# EasyEDA Pro project MalO_SAO_EasyEDA.eprj, schematic Schematic1

## Sheets
1 Periphreals: Board Name: Board1; Create Date: 2026-02-11; Page Name: Periphreals; Project Name: MalO_SAO_EasyEDA; Schematic Name: Schematic1; Update Date: 2026-05-29; Company: EasyEDA.com; Page Size: A4; Version: V1.0
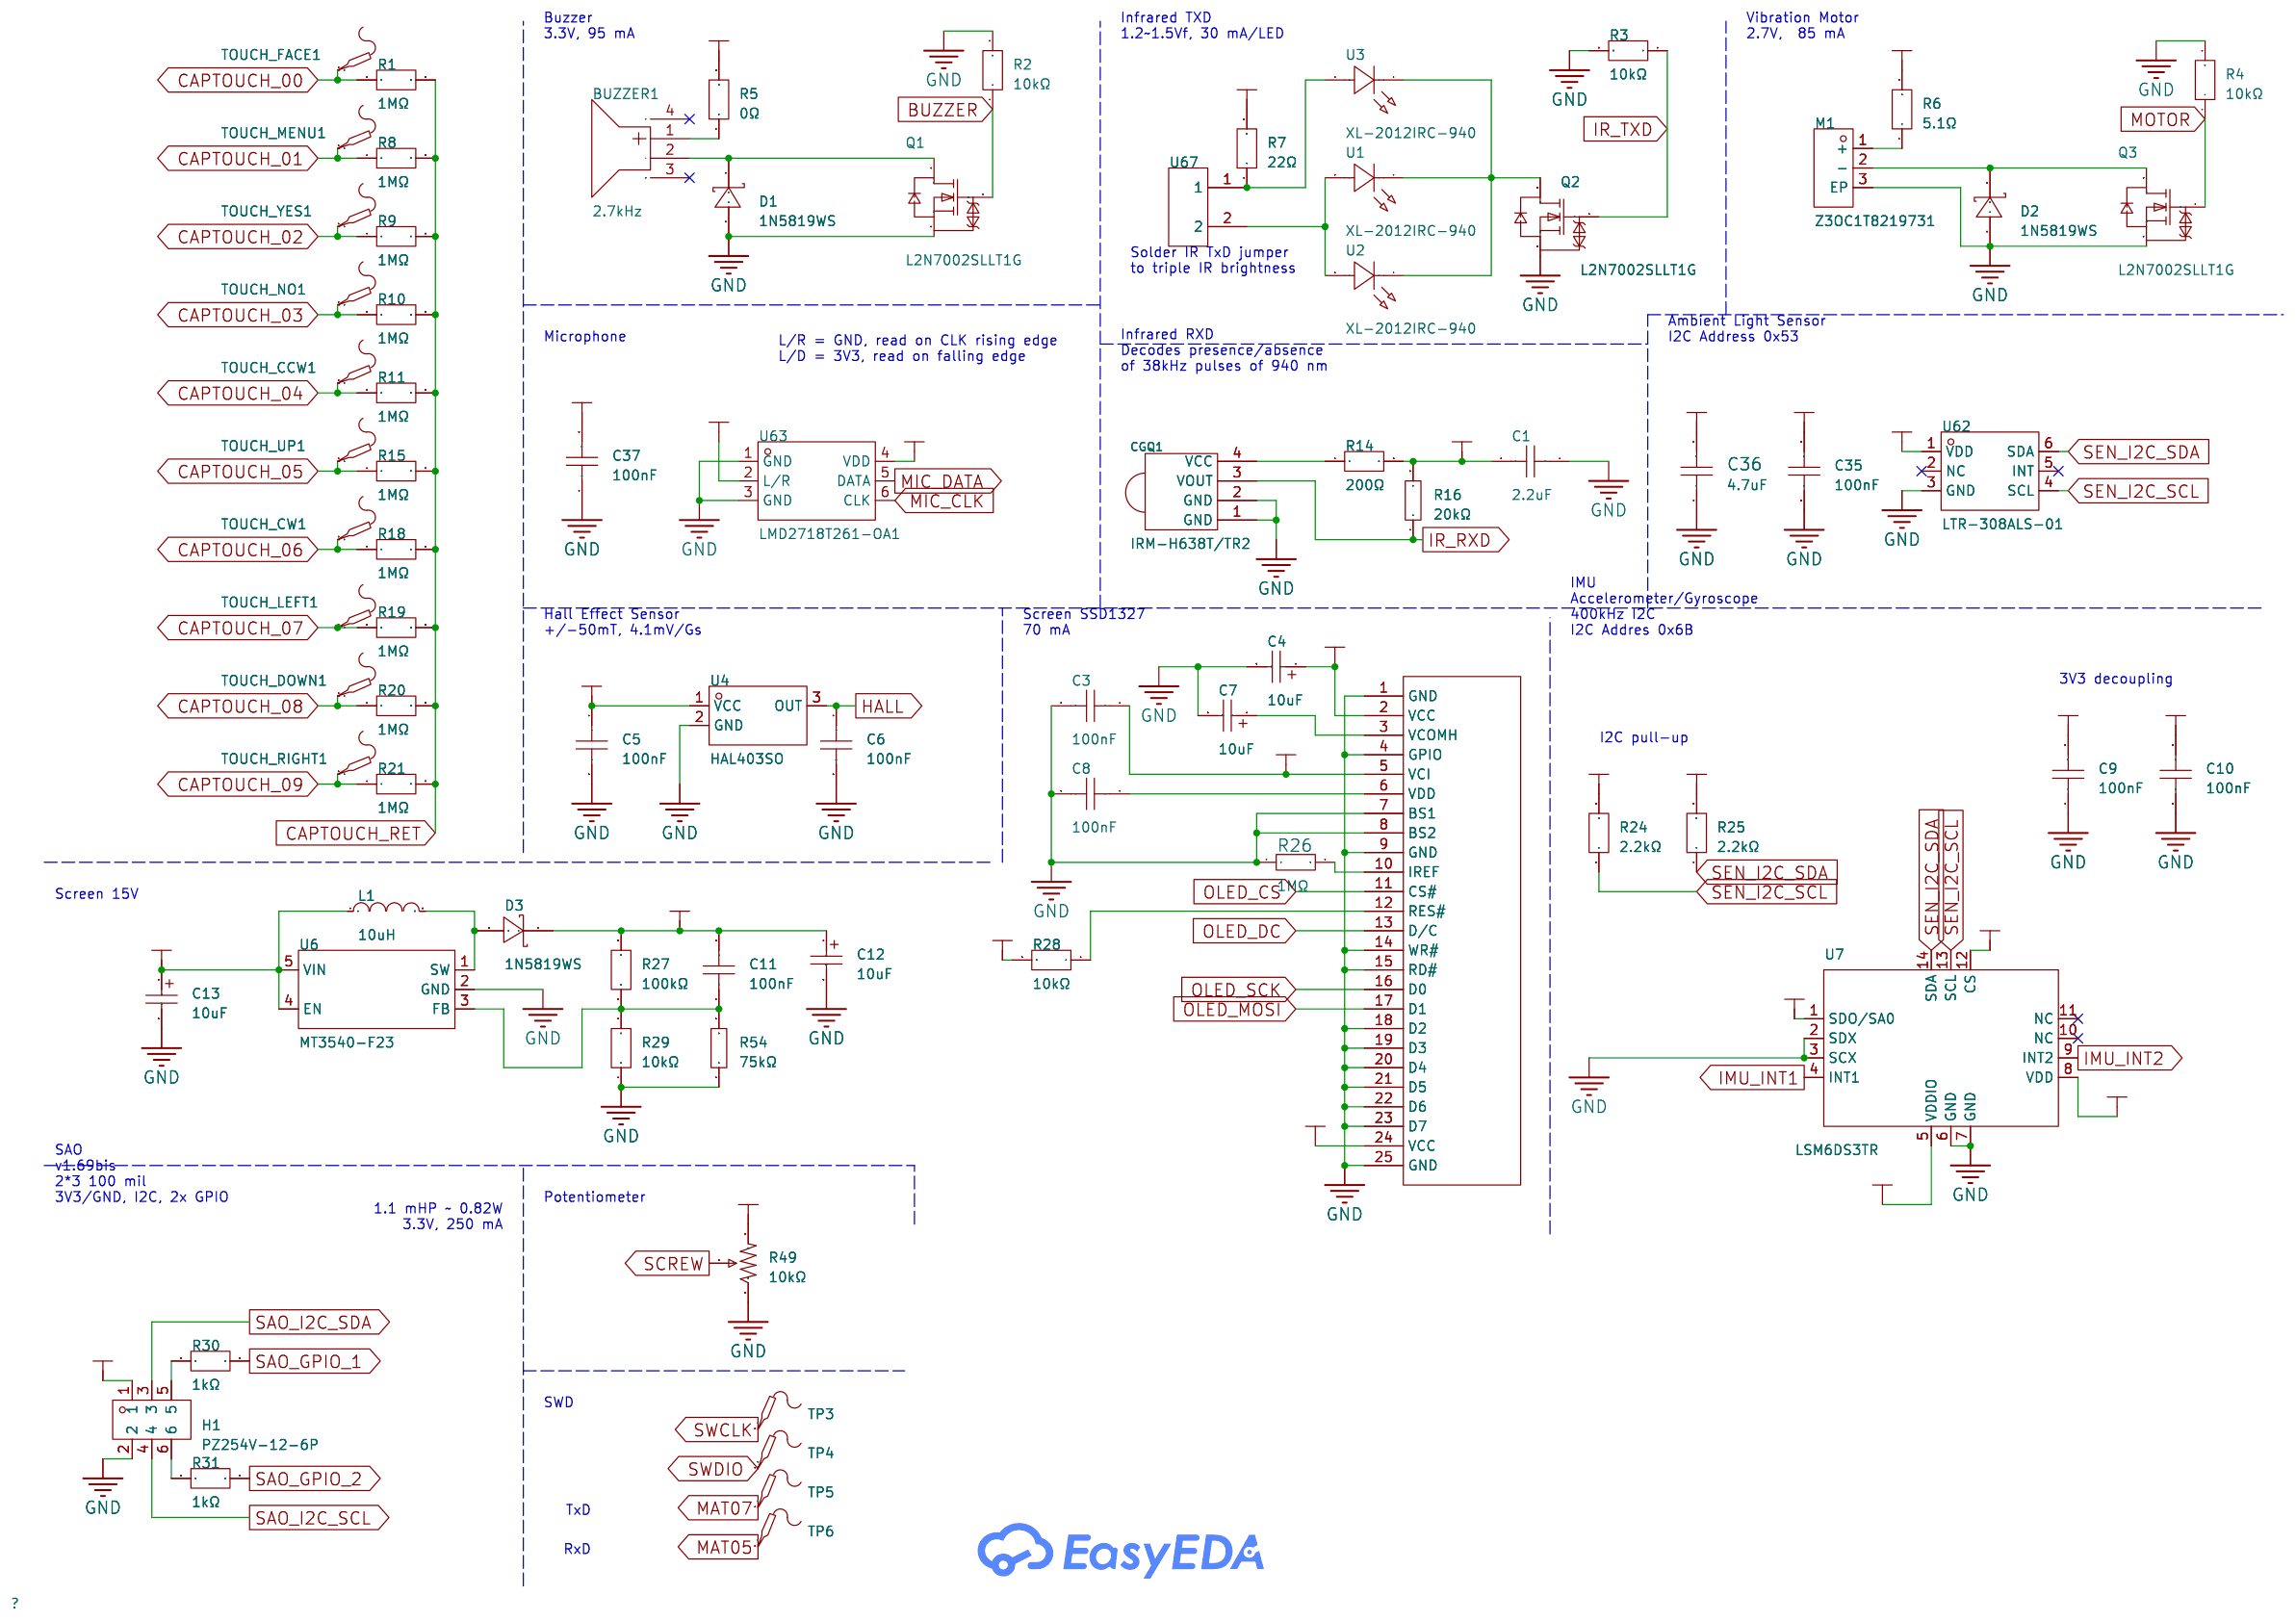
[diagram p0: Periphreals]
2 LowerLED: Create Date: 2026-02-27; Page Name: LowerLED; Update Date: 2026-05-30
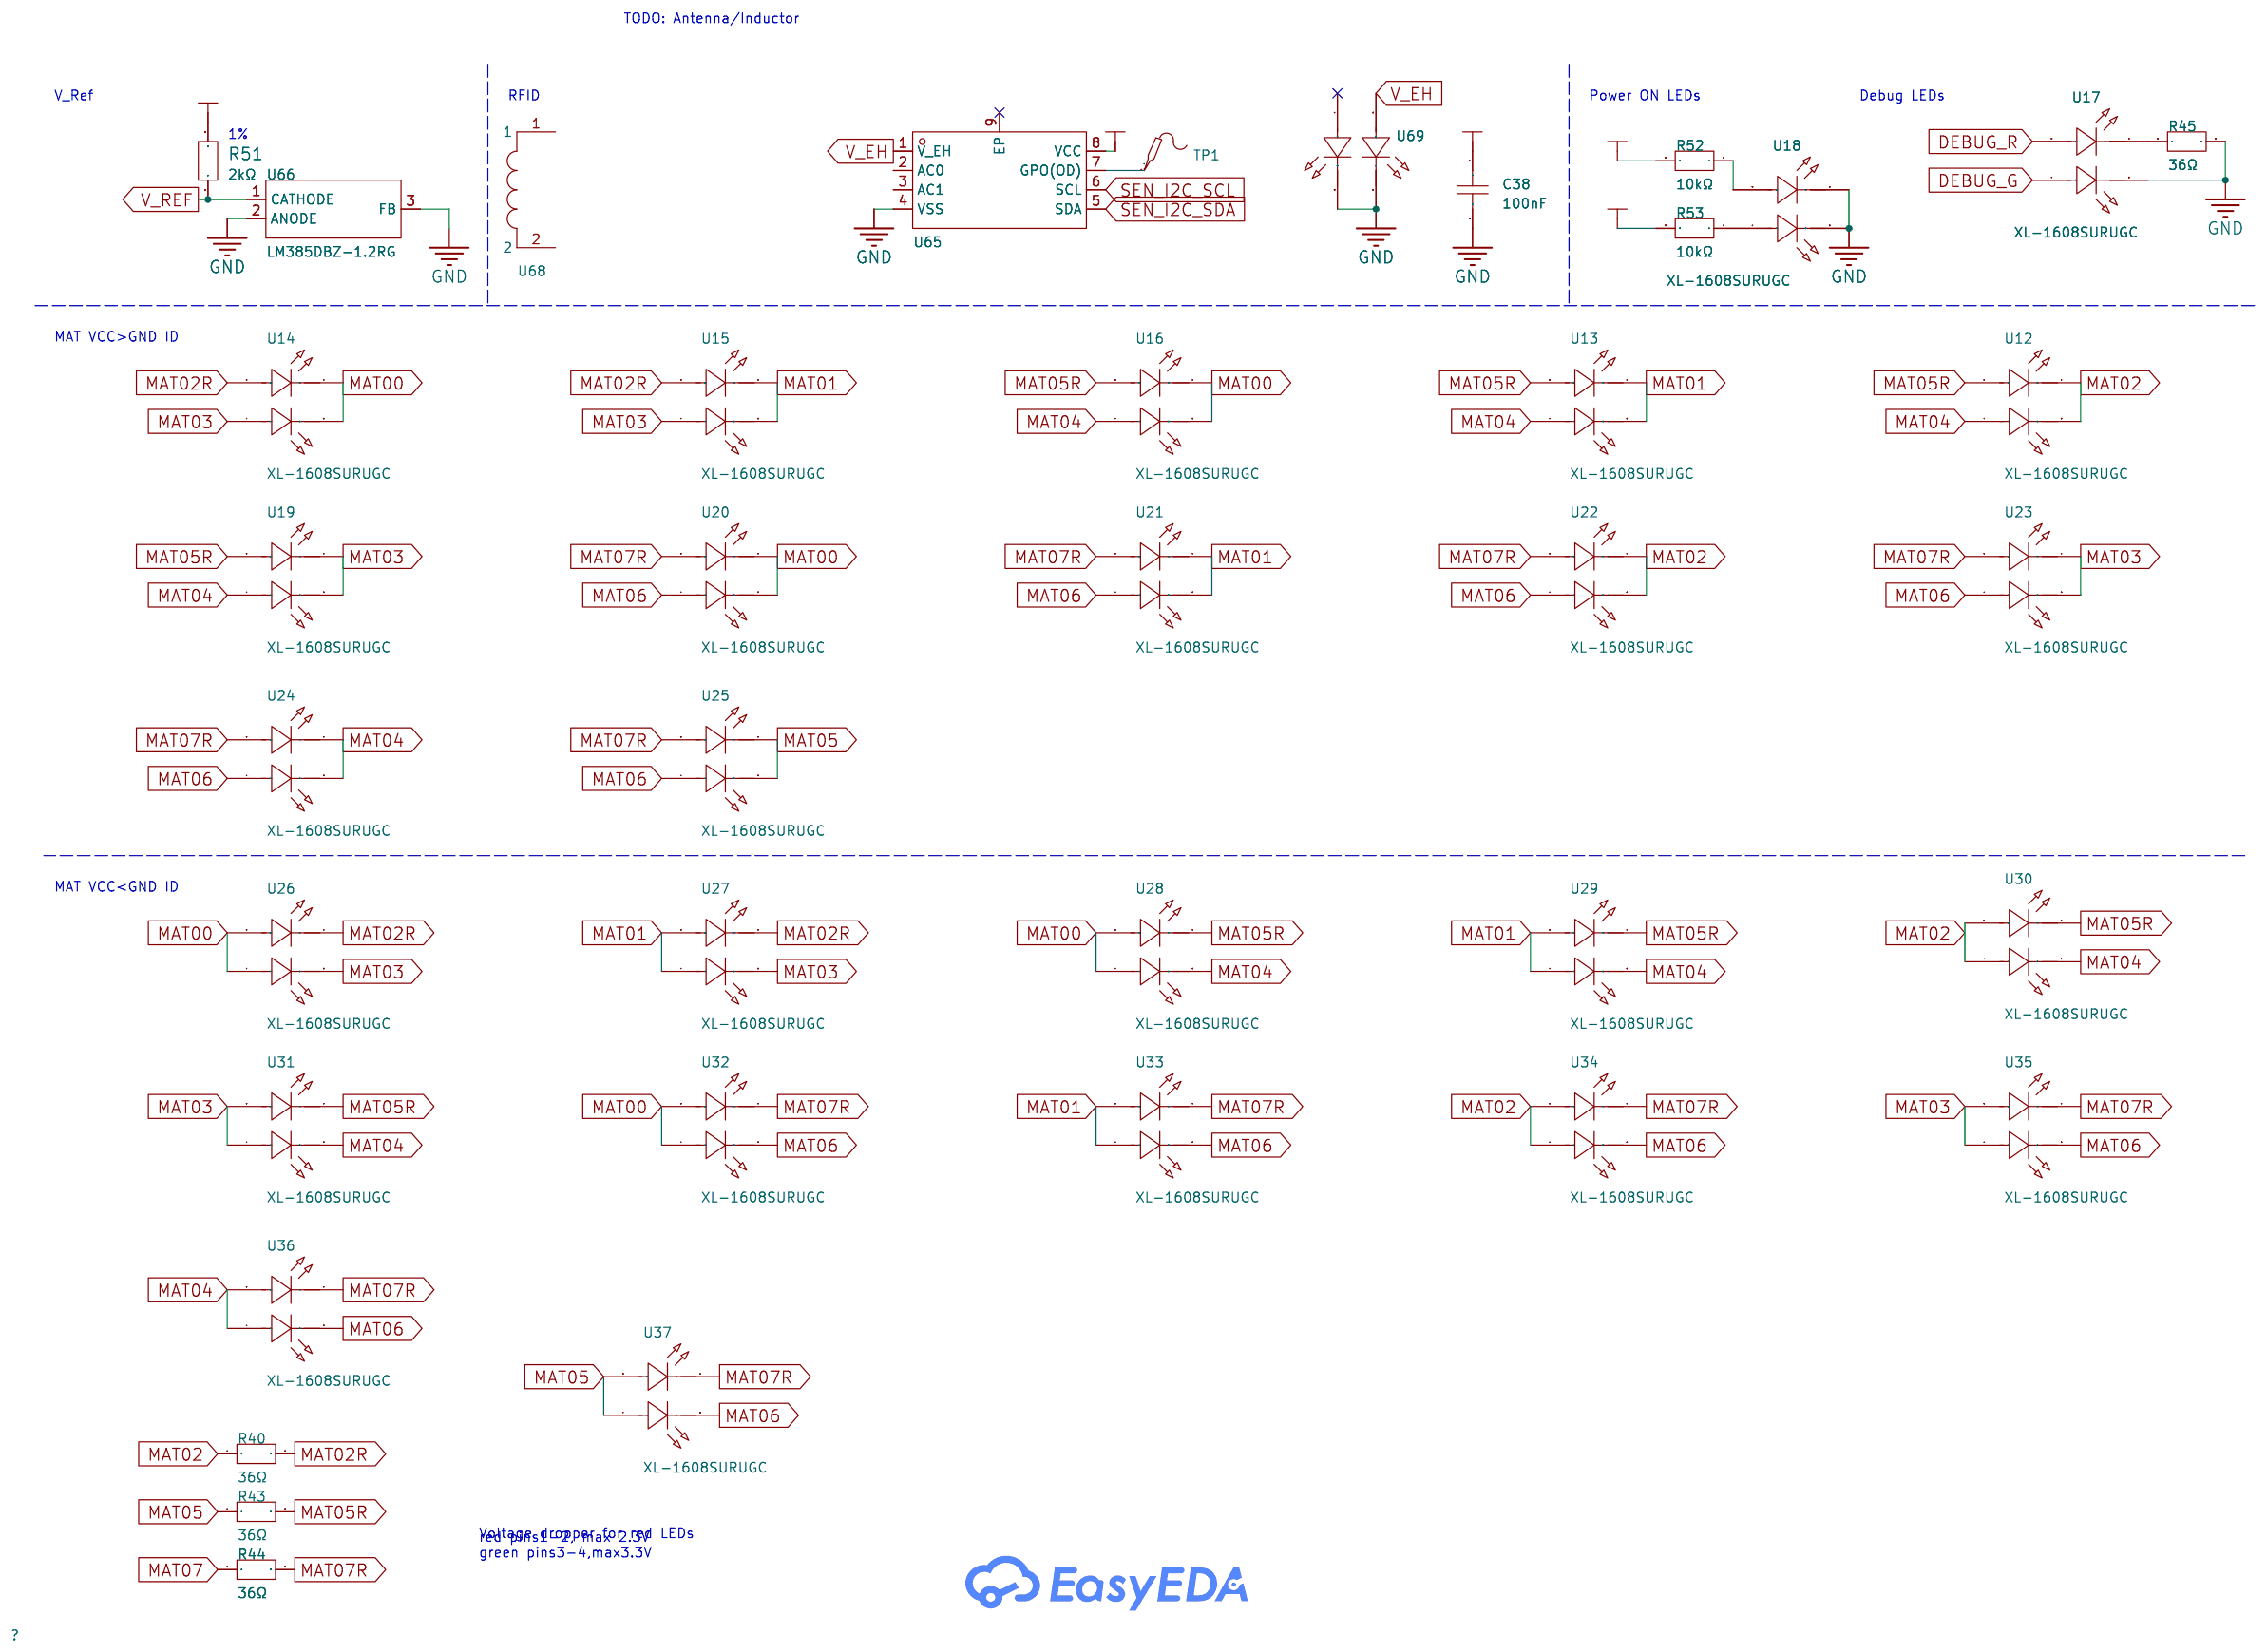
[diagram p1: LowerLED]
3 Processor_Power: Create Date: 2026-02-27; Page Name: Processor_Power; Update Date: 2026-05-25
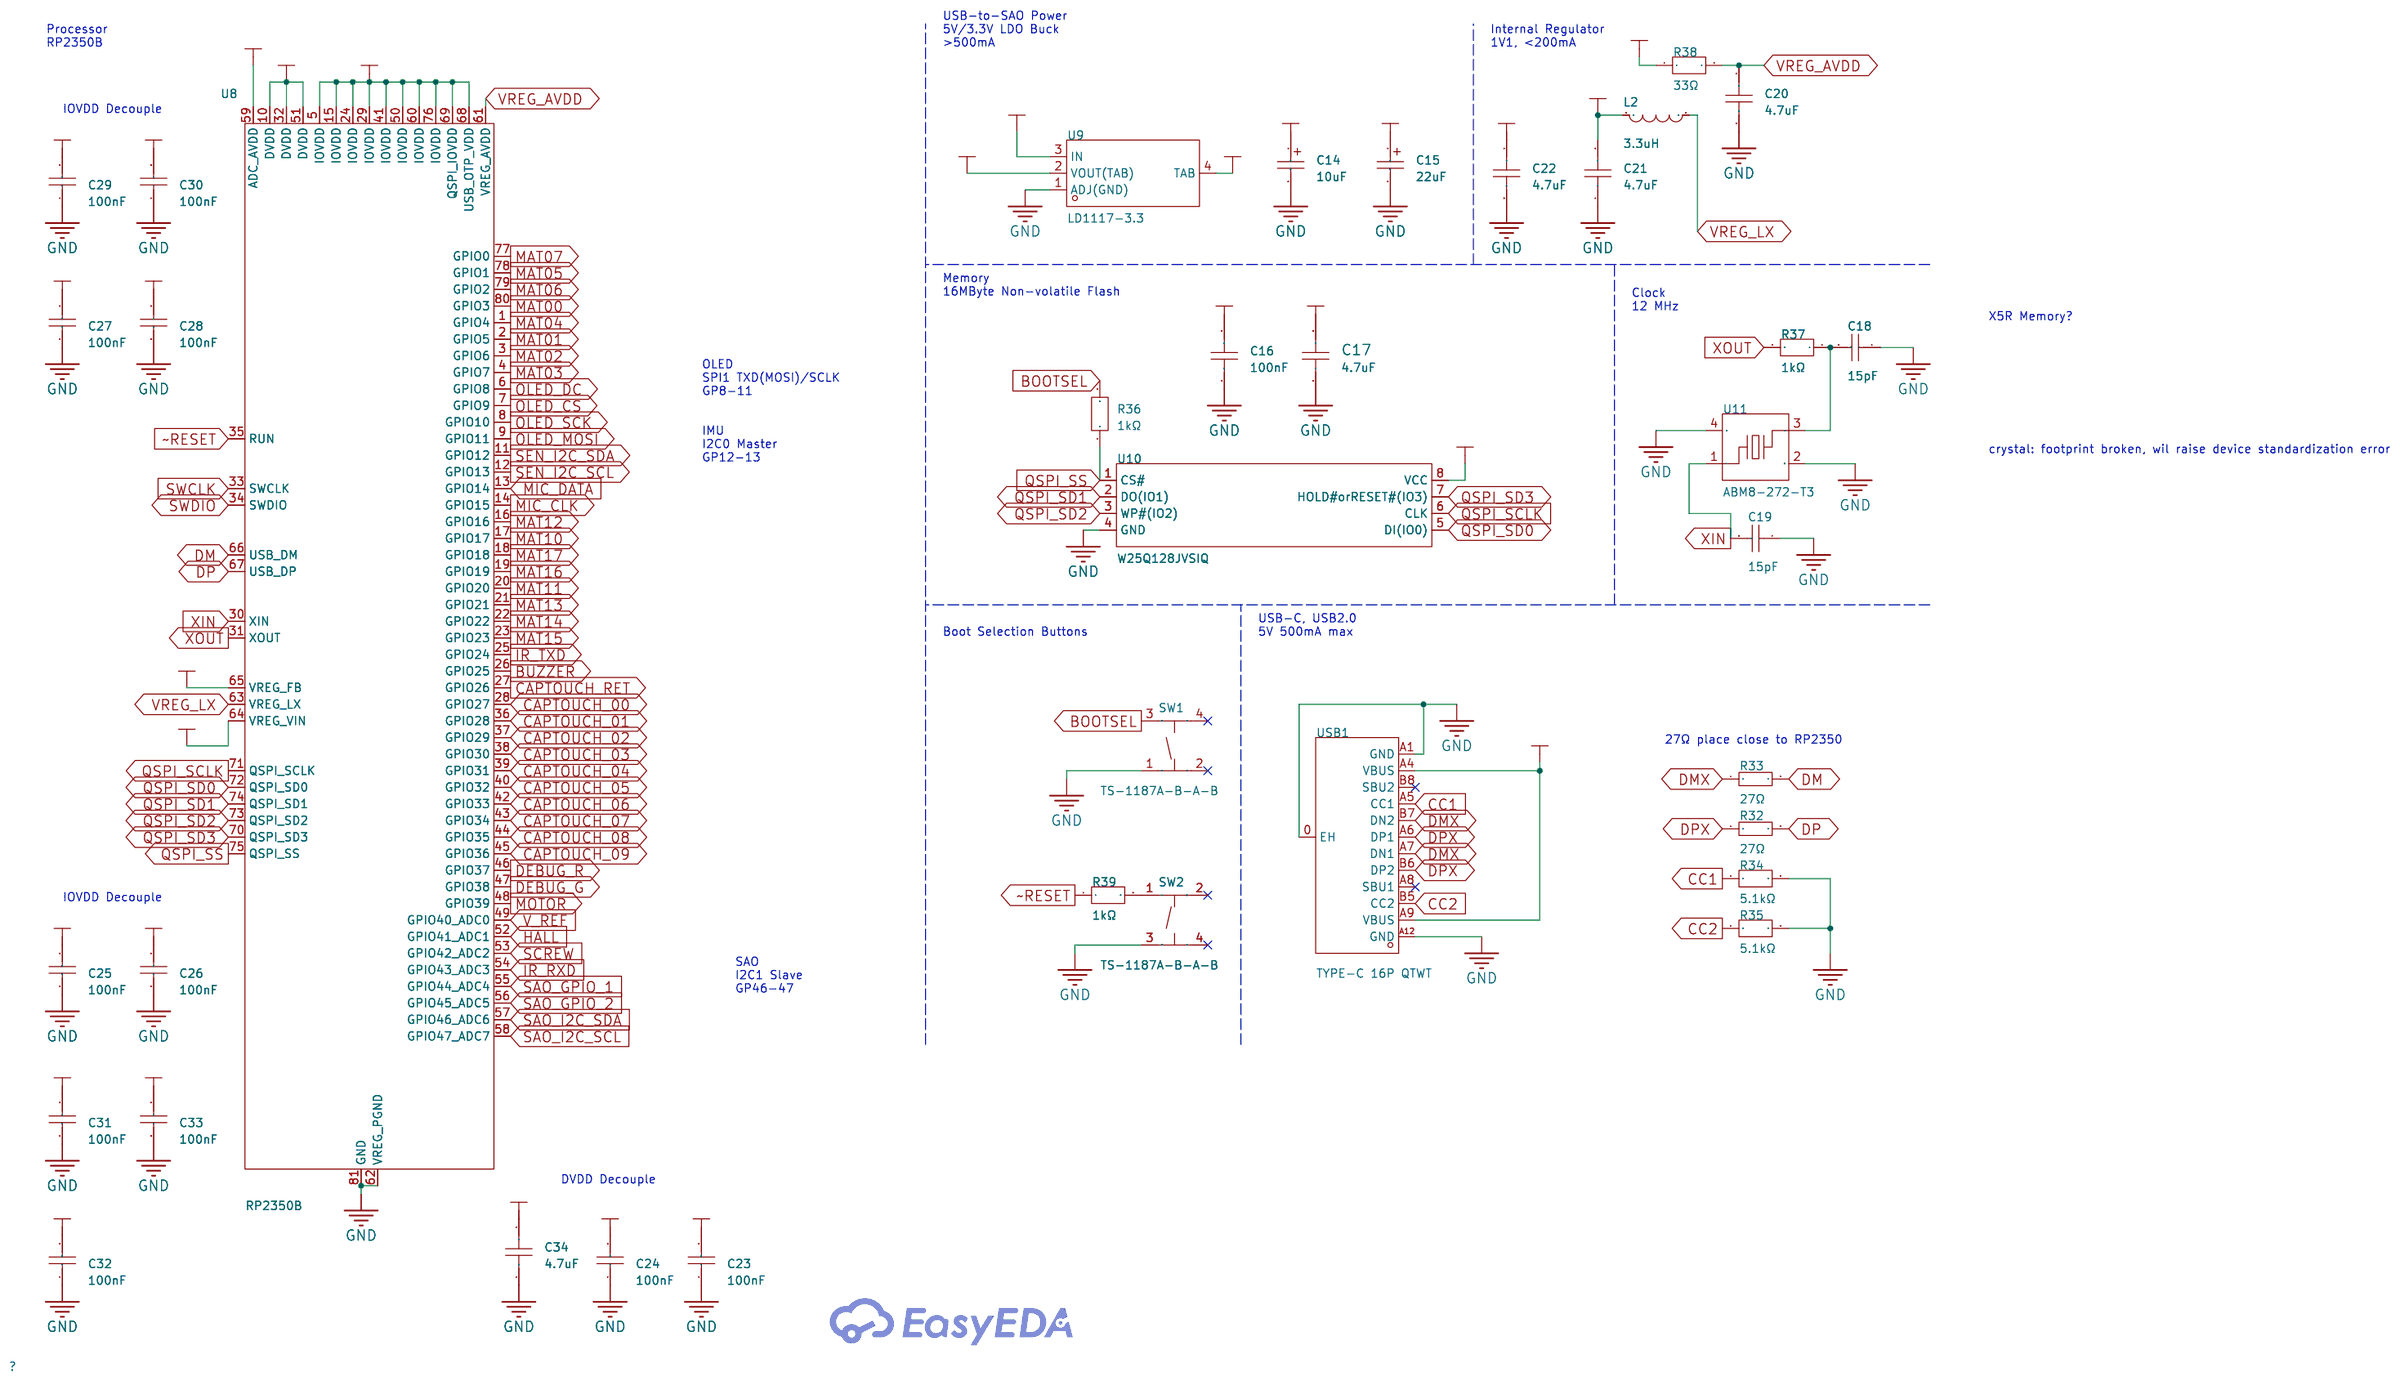
[diagram p2: Processor_Power]
4 UpperLED: Create Date: 2026-03-27; Page Name: UpperLED; Update Date: 2026-03-28
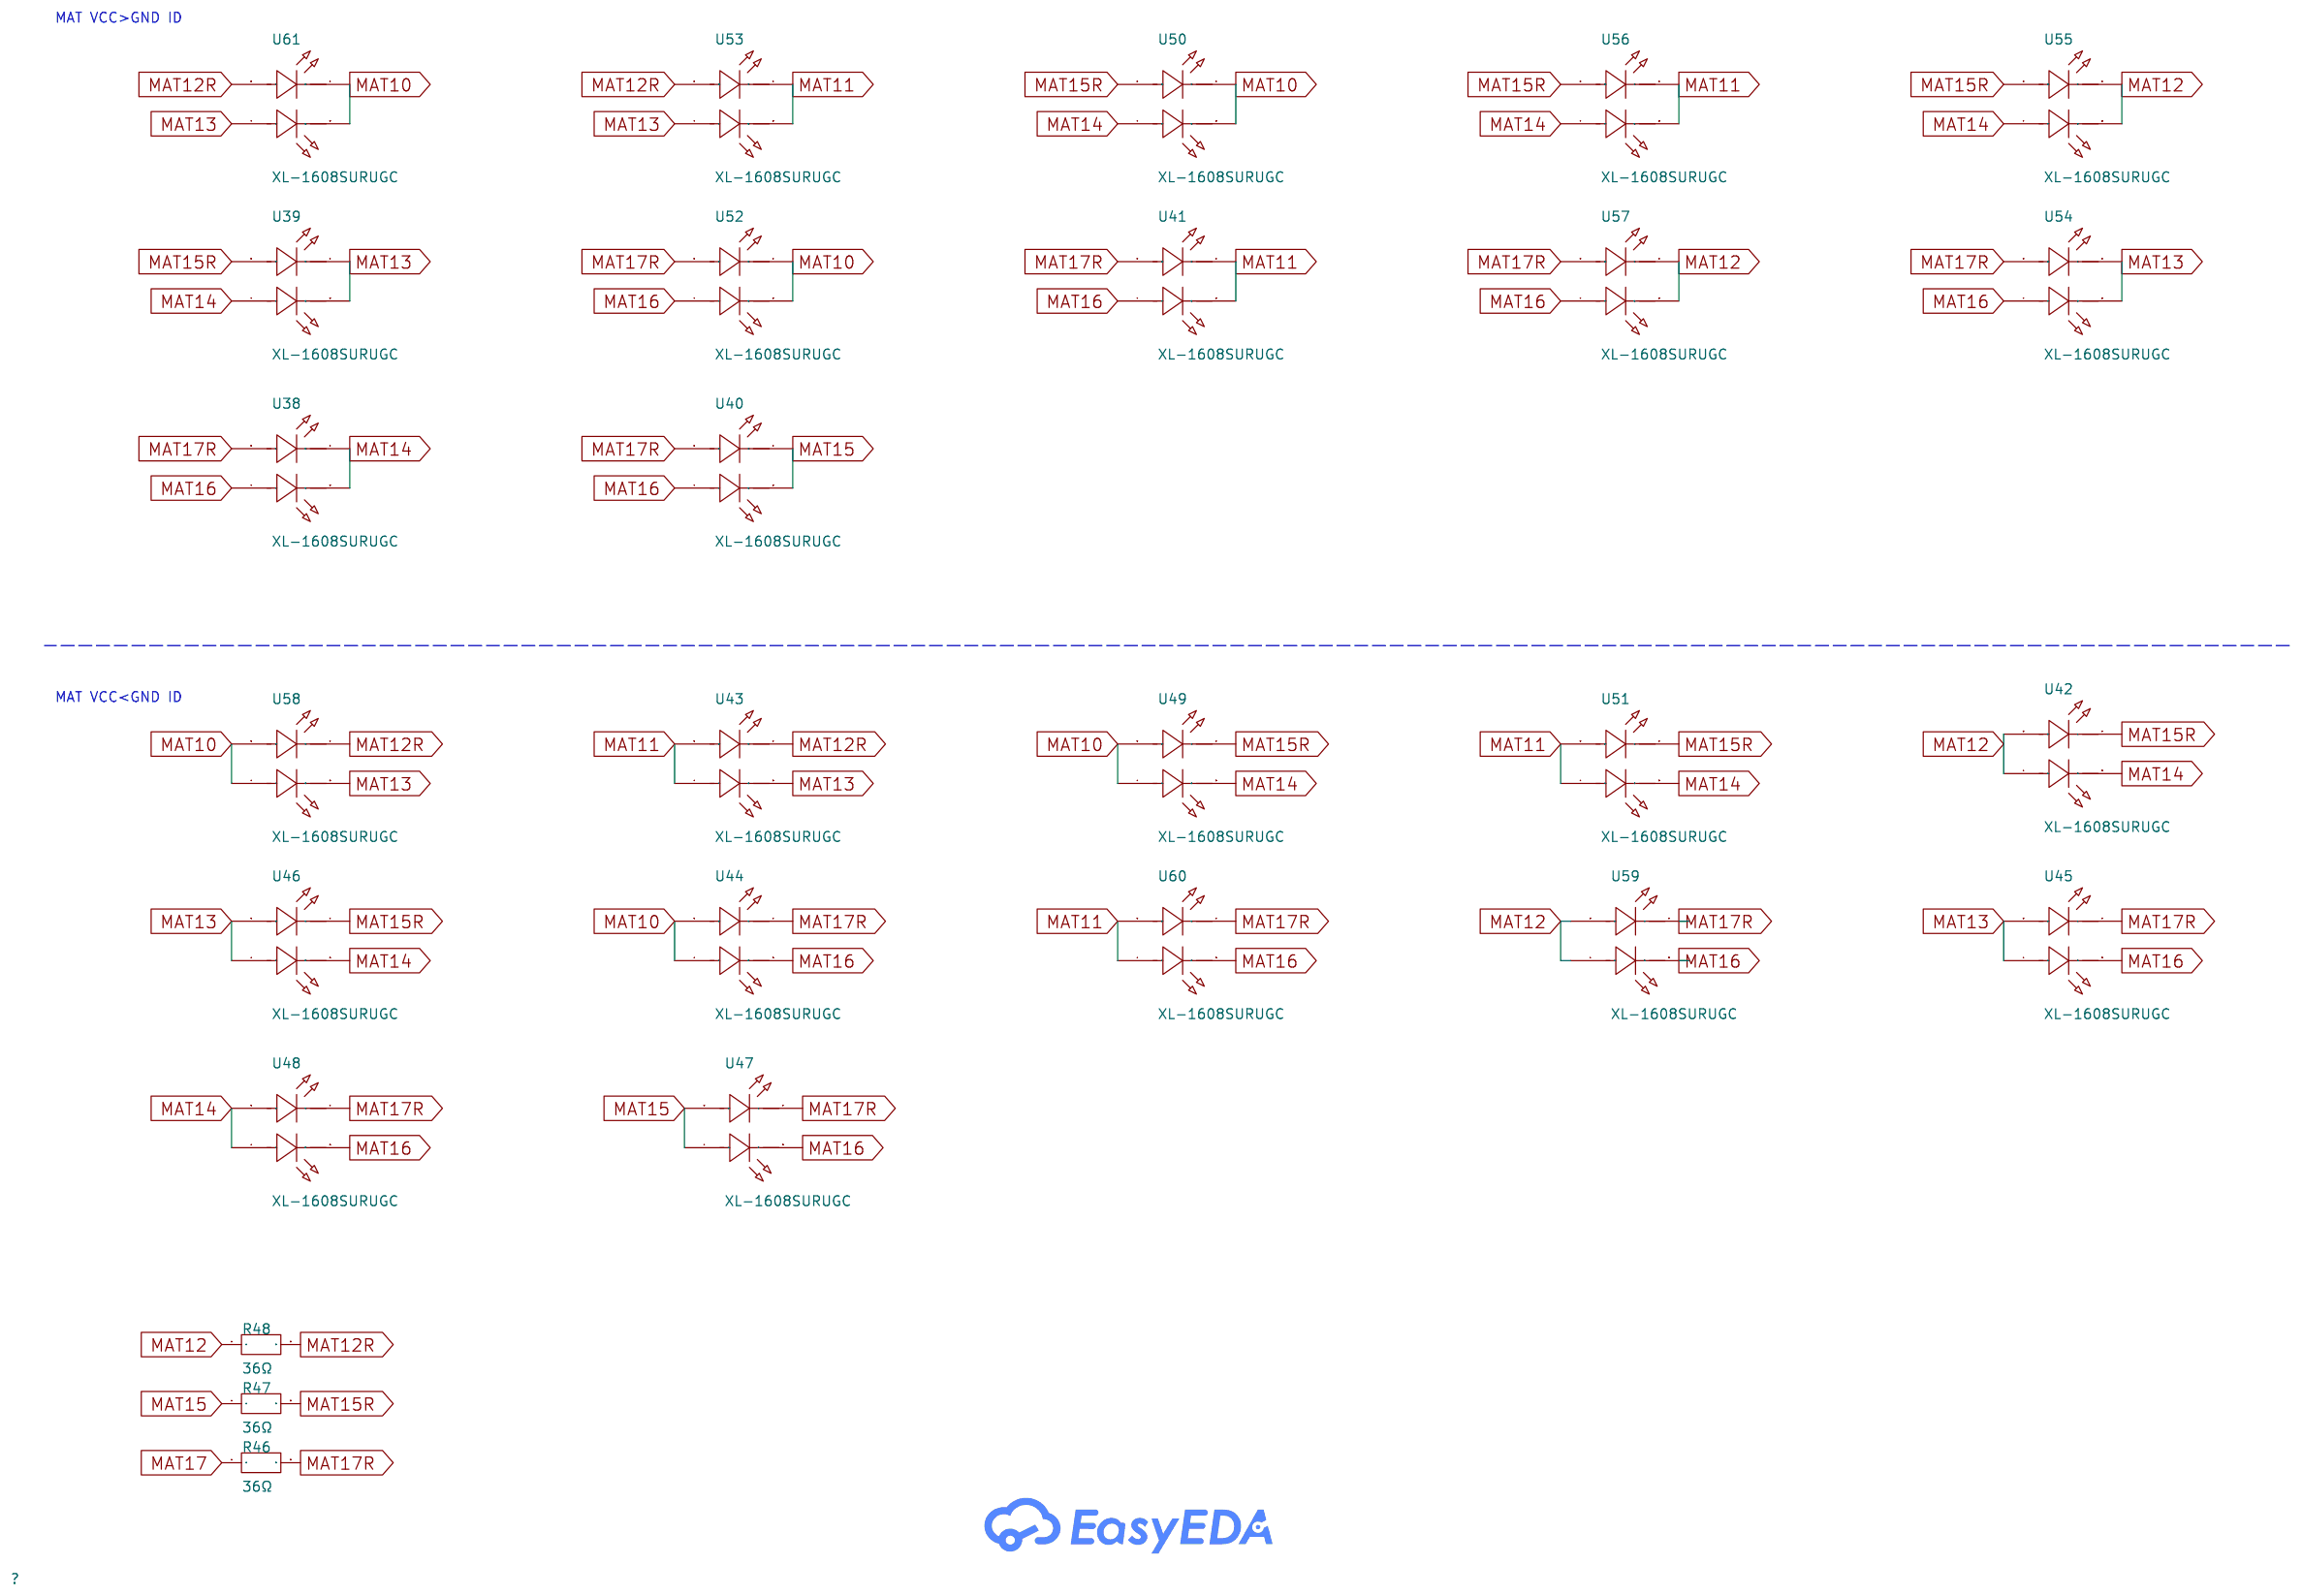
[diagram p3: UpperLED]

## Parts
sheet LowerLED
C38  100nF  [C0402]
R40  36Ω  [R0402]
R43  36Ω  [R0402]
R44  36Ω  [R0402]
R45  36Ω  [R0402]
R51  2kΩ  [R0402]
R52  10kΩ  [R0402]
R53  10kΩ  [R0402]
TP1  -  [Test-Point-0.5mm]
U12  XL-1608SURUGC  [LED-SMD_4P-L1.6-W0.8-RD_1]
U13  XL-1608SURUGC  [LED-SMD_4P-L1.6-W0.8-RD_1]
U14  XL-1608SURUGC  [LED-SMD_4P-L1.6-W0.8-RD_1]
U15  XL-1608SURUGC  [LED-SMD_4P-L1.6-W0.8-RD_1]
U16  XL-1608SURUGC  [LED-SMD_4P-L1.6-W0.8-RD_1]
U17  XL-1608SURUGC  [LED-SMD_4P-L1.6-W0.8-RD_1]
U18  XL-1608SURUGC  [LED-SMD_4P-L1.6-W0.8-RD_1]
U19  XL-1608SURUGC  [LED-SMD_4P-L1.6-W0.8-RD_1]
U20  XL-1608SURUGC  [LED-SMD_4P-L1.6-W0.8-RD_1]
U21  XL-1608SURUGC  [LED-SMD_4P-L1.6-W0.8-RD_1]
U22  XL-1608SURUGC  [LED-SMD_4P-L1.6-W0.8-RD_1]
U23  XL-1608SURUGC  [LED-SMD_4P-L1.6-W0.8-RD_1]
U24  XL-1608SURUGC  [LED-SMD_4P-L1.6-W0.8-RD_1]
U25  XL-1608SURUGC  [LED-SMD_4P-L1.6-W0.8-RD_1]
U26  XL-1608SURUGC  [LED-SMD_4P-L1.6-W0.8-RD_1]
U27  XL-1608SURUGC  [LED-SMD_4P-L1.6-W0.8-RD_1]
U28  XL-1608SURUGC  [LED-SMD_4P-L1.6-W0.8-RD_1]
U29  XL-1608SURUGC  [LED-SMD_4P-L1.6-W0.8-RD_1]
U30  XL-1608SURUGC  [LED-SMD_4P-L1.6-W0.8-RD_1]
U31  XL-1608SURUGC  [LED-SMD_4P-L1.6-W0.8-RD_1]
U32  XL-1608SURUGC  [LED-SMD_4P-L1.6-W0.8-RD_1]
U33  XL-1608SURUGC  [LED-SMD_4P-L1.6-W0.8-RD_1]
U34  XL-1608SURUGC  [LED-SMD_4P-L1.6-W0.8-RD_1]
U35  XL-1608SURUGC  [LED-SMD_4P-L1.6-W0.8-RD_1]
U36  XL-1608SURUGC  [LED-SMD_4P-L1.6-W0.8-RD_1]
U37  XL-1608SURUGC  [LED-SMD_4P-L1.6-W0.8-RD_1]
U65  13.56MHz  [UFDFN-8_L3.0-W2.0-P0.50-TL-EP1.4]
U66  LM385DBZ-1.2RG  [SOT-23-3_L2.9-W1.6-P1.90-LS2.8-BR]
U68  -  [rfid_antenna]  (no BOM)
U69  XL-1608SURUGC  [LED-SMD_4P-L1.6-W0.8-RD_1]
sheet Periphreals
BUZZER1  2.7kHz  [BUZ-SMD_4P-L7.5-W7.5-P7.59-TL]
C1  2.2uF  [C0402]
C3  100nF  [C0402]
C4  10uF  [CASE-A_3216]
C5  100nF  [C0402]
C6  100nF  [C0402]
C7  10uF  [CASE-A_3216]
C8  100nF  [C0402]
C9  100nF  [C0402]
C10  100nF  [C0402]
C11  100nF  [C0402]
C12  10uF  [CASE-A_3216]
C13  10uF  [CASE-A_3216]
C35  100nF  [C0402]
C36  4.7uF  [C0402]
C37  100nF  [C0402]
CGQ1  IRM-H638T/TR2  [SENSOR-SMD_IRM-H638T-TR2-TL]
D1  1N5819WS  [SOD-323_L1.8-W1.3-LS2.5-RD]
D2  1N5819WS  [SOD-323_L1.8-W1.3-LS2.5-RD]
D3  1N5819WS  [SOD-323_L1.8-W1.3-LS2.5-RD]
H1  PZ254V-12-6P  [HDR-TH_6P-P2.54-V-M-R2-C3-S2.54]
L1  10uH  [L0603]
M1  Z3OC1T8219731  [VIBRATING-MOTOR-SMD_3P-C9900001680]
Q1  L2N7002SLLT1G  [SOT-23-3_L3.0-W1.7-P0.95-LS2.9-BR]
Q2  L2N7002SLLT1G  [SOT-23-3_L3.0-W1.7-P0.95-LS2.9-BR]
Q3  L2N7002SLLT1G  [SOT-23-3_L3.0-W1.7-P0.95-LS2.9-BR]
R1  1MΩ  [R0402]
R2  10kΩ  [R0402]
R3  10kΩ  [R0402]
R4  10kΩ  [R0402]
R5  0Ω  [R0402]
R6  5.1Ω  [R0402]
R7  22Ω  [R0805]
R8  1MΩ  [R0402]
R9  1MΩ  [R0402]
R10  1MΩ  [R0402]
R11  1MΩ  [R0402]
R14  200Ω  [R0402]
R15  1MΩ  [R0402]
R16  20kΩ  [R0402]  (no BOM)
R18  1MΩ  [R0402]
R19  1MΩ  [R0402]
R20  1MΩ  [R0402]
R21  1MΩ  [R0402]
R24  2.2kΩ  [R0402]
R25  2.2kΩ  [R0402]
R26  1MΩ  [R0402]
R27  100kΩ  [R0402]
R28  10kΩ  [R0402]
R29  10kΩ  [R0402]
R30  1kΩ  [R0402]
R31  1kΩ  [R0402]
R49  10kΩ  [RES-ADJ-SMD_3P-L3.0-W3.8-P1.75-BR]
R54  75kΩ  [R0402]
TOUCH_CCW1  -  [touch_12mm]
TOUCH_CW1  -  [touch_12mm]
TOUCH_DOWN1  -  [touch_12mm]
TOUCH_FACE1  -  [touch_12mm]
TOUCH_LEFT1  -  [touch_12mm]
TOUCH_MENU1  -  [touch_12mm]
TOUCH_NO1  -  [touch_12mm]
TOUCH_RIGHT1  -  [touch_12mm]
TOUCH_UP1  -  [touch_12mm]
TOUCH_YES1  -  [touch_12mm]
TP3  -  [Test-Point-0.5mm]
TP4  -  [Test-Point-0.5mm]
TP5  -  [Test-Point-0.5mm]
TP6  -  [Test-Point-0.5mm]
U1  XL-2012IRC-940  [LED0805-RD]
U2  XL-2012IRC-940  [LED0805-RD]
U3  XL-2012IRC-940  [LED0805-RD]
U4  HAL403SO  [SOT-23-3_L2.9-W1.3-P1.90-LS2.4-BR-CW]
U5  -  [ssd1327_128x128]
U6  MT3540-F23  [SOT-23-5_L3.0-W1.7-P0.95-LS2.8-BR]
U7  LSM6DS3TR  [LGA-14_L3.0-W2.5-P0.50-TL]
U62  LTR-308ALS-01  [SENSOR-SMD_6P-L2.0-W2.0-P0.65-BL]
U63  LMD2718T261-OA1  [MIC-SMD_6P-L2.8-W1.9-P0.98-TL]
U67  -  [open_solder_jumper]  (no BOM)
sheet Processor_Power
C14  10uF  [CASE-A_3216]
C15  22uF  [CASE-A_3216]
C16  100nF  [C0402]
C17  4.7uF  [C0402]
C18  15pF  [C0402]
C19  15pF  [C0402]
C20  4.7uF  [C0402]
C21  4.7uF  [C0402]
C22  4.7uF  [C0402]
C23  100nF  [C0402]
C24  100nF  [C0402]
C25  100nF  [C0402]
C26  100nF  [C0402]
C27  100nF  [C0402]
C28  100nF  [C0402]
C29  100nF  [C0402]
C30  100nF  [C0402]
C31  100nF  [C0402]
C32  100nF  [C0402]
C33  100nF  [C0402]
C34  4.7uF  [C0402]
L2  3.3uH  [IND-SMD_L2.0-W1.6_AOTA-B201610S3R3-101-T]
R32  27Ω  [R0603]
R33  27Ω  [R0603]
R34  5.1kΩ  [R0603]
R35  5.1kΩ  [R0603]
R36  1kΩ  [R0402]
R37  1kΩ  [R0402]
R38  33Ω  [R0402]
R39  1kΩ  [R0402]
SW1  TS-1187A-B-A-B  [SW-SMD_4P-L5.1-W5.1-P3.70-LS6.5-TL_H1.5]
SW2  TS-1187A-B-A-B  [SW-SMD_4P-L5.1-W5.1-P3.70-LS6.5-TL_H1.5]
U8  RP2350B  [QFN-80_L10.0-W10.0-P0.40-TL-EP3.4]
U9  LD1117-3.3  [SOT-223_L6.7-W3.5-P2.30-BR]
U10  W25Q128JVSIQ  [SOIC-8_L5.3-W5.3-P1.27-LS8.0-BL]
U11  ABM8-272-T3  [SMD3225-4P_SMD3225-4P]
USB1  TYPE-C 16P QTWT  [USB-TYPE-C-SMD_TYPE-C-16P-QTWT]
sheet UpperLED
R46  36Ω  [R0402]
R47  36Ω  [R0402]
R48  36Ω  [R0402]
U38  XL-1608SURUGC  [LED-SMD_4P-L1.6-W0.8-RD_1]
U39  XL-1608SURUGC  [LED-SMD_4P-L1.6-W0.8-RD_1]
U40  XL-1608SURUGC  [LED-SMD_4P-L1.6-W0.8-RD_1]
U41  XL-1608SURUGC  [LED-SMD_4P-L1.6-W0.8-RD_1]
U42  XL-1608SURUGC  [LED-SMD_4P-L1.6-W0.8-RD_1]
U43  XL-1608SURUGC  [LED-SMD_4P-L1.6-W0.8-RD_1]
U44  XL-1608SURUGC  [LED-SMD_4P-L1.6-W0.8-RD_1]
U45  XL-1608SURUGC  [LED-SMD_4P-L1.6-W0.8-RD_1]
U46  XL-1608SURUGC  [LED-SMD_4P-L1.6-W0.8-RD_1]
U47  XL-1608SURUGC  [LED-SMD_4P-L1.6-W0.8-RD_1]
U48  XL-1608SURUGC  [LED-SMD_4P-L1.6-W0.8-RD_1]
U49  XL-1608SURUGC  [LED-SMD_4P-L1.6-W0.8-RD_1]
U50  XL-1608SURUGC  [LED-SMD_4P-L1.6-W0.8-RD_1]
U51  XL-1608SURUGC  [LED-SMD_4P-L1.6-W0.8-RD_1]
U52  XL-1608SURUGC  [LED-SMD_4P-L1.6-W0.8-RD_1]
U53  XL-1608SURUGC  [LED-SMD_4P-L1.6-W0.8-RD_1]
U54  XL-1608SURUGC  [LED-SMD_4P-L1.6-W0.8-RD_1]
U55  XL-1608SURUGC  [LED-SMD_4P-L1.6-W0.8-RD_1]
U56  XL-1608SURUGC  [LED-SMD_4P-L1.6-W0.8-RD_1]
U57  XL-1608SURUGC  [LED-SMD_4P-L1.6-W0.8-RD_1]
U58  XL-1608SURUGC  [LED-SMD_4P-L1.6-W0.8-RD_1]
U59  XL-1608SURUGC  [LED-SMD_4P-L1.6-W0.8-RD_1]
U60  XL-1608SURUGC  [LED-SMD_4P-L1.6-W0.8-RD_1]
U61  XL-1608SURUGC  [LED-SMD_4P-L1.6-W0.8-RD_1]

## Library data of the parts
C3 C5 C6 C8-C11 C16 C35 C37 C38 = CL05B104KB54PNC: LCSC Part Name: 100nF ±10% 50V; Supplier Part: C307331; Manufacturer: SAMSUNG(三星); Supplier Footprint: 0402; JLCPCB Part Class: Basic Part; Datasheet: https://item.szlcsc.com/datasheet/CL05B104KB54PNC/291005.html; Supplier: LCSC; Tolerance: ±10%; Voltage Rating: 50V; Temperature Coefficient: X7R
R40 R43-R48 = FRC0402F36R0TS: LCSC Part Name: 36Ω ±1% 62.5mW 厚膜电阻; Supplier Part: C2998152; Manufacturer: FOJAN(富捷); Supplier Footprint: 0402; JLCPCB Part Class: Extended Part; Supplier: LCSC; Type: Thick Film Resistor; Tolerance: ±1%; Power(Watts): 62.5mW; Voltage-Supply(Max): 50V; Temperature Coefficient: ±100ppm/℃; Operating Temperature: -55℃~+155℃
R51 = FRC0402F2001TS: LCSC Part Name: 2kΩ ±1% 62.5mW 厚膜电阻; Supplier Part: C2909344; Manufacturer: FOJAN(富捷); Supplier Footprint: 0402; JLCPCB Part Class: Extended Part; Supplier: LCSC; Type: Thick Film Resistor; Tolerance: ±1%; Power(Watts): 62.5mW; Voltage-Supply(Max): 50V; Temperature Coefficient: ±100ppm/℃; Operating Temperature: -55℃~+155℃
R2-R4 R28 R29 R52 R53 = FRC0402J103 TS: LCSC Part Name: 10kΩ ±5% 62.5mW 厚膜电阻; Supplier Part: C2906885; Manufacturer: FOJAN(富捷); Supplier Footprint: 0402; JLCPCB Part Class: Extended Part; Supplier: LCSC; Type: Thick Film Resistor; Tolerance: ±5%; Power(Watts): 62.5mW; Voltage-Supply(Max): 50V; Temperature Coefficient: ±100ppm/℃; Operating Temperature: -55℃~+155℃
TOUCH_CCW1 TOUCH_CW1 TOUCH_DOWN1 TOUCH_FACE1 TOUCH_LEFT1 TOUCH_MENU1 TOUCH_NO1 TOUCH_RIGHT1 TOUCH_UP1 TOUCH_YES1 TP1 TP3-TP6 = Test-Point
U12-U61 U69 = XL-1608SURUGC: Illumination Color:Red, Emerald Green Voltage - Forward(Vf):1.8V~2.6V；2.8V~3.5V Voltage - Forward(Vf):1.8V~2.6V；2.8V~3.5V Power(Watts):- Forward Current:- Wavelength - Dominant:520nm~530nm；620nm~630nm Wavelength - Dominant:520nm~530nm；620nm~630nm Peak Wav; LCSC Part Name: 0603红翠绿双色贴片式发光二极管; Supplier Part: C5349934; Manufacturer: XINGLIGHT(成兴光); Supplier Footprint: SMD-4P,1.6x0.8mm; JLCPCB Part Class: Extended Part; Datasheet: https://item.szlcsc.com/datasheet/XL-1608SURUGC/6136383.html; Supplier: LCSC; Illumination Color: Red, Emerald Green; Voltage - Forward(Vf): 1.8V~2.6V；2.8V~3.5V; Wavelength - Dominant: 520nm~530nm；620nm~630nm; Lens Color: Water Clear; Luminous Intensity: 150mcd；550mcd; Viewing Angle: 120°; Mounting Style: op View Mount
U65 = ST25DV04K-IER6C3: LCSC Part Name: 动态NFC/RFID标签IC，带4-Kbit、16-Kbit或64-Kbit EEPROM及快速传输模式功能; Supplier Part: C2908287; Manufacturer: ST(意法半导体); Supplier Footprint: UFDFN-8-EP(2x3); JLCPCB Part Class: Extended Part; Datasheet: https://item.szlcsc.com/datasheet/ST25DV04K-IER6C3/3183829.html; Supplier: LCSC; agreement: ISO 15693,NFC; Interface: I2C; transmission rate: 53Kbit/s; Voltage - Supply: 1.8V~5.5V; Quiescent Current: 1uA
U66 = LM385DBZ-1.2RG: LCSC Part Name: 1.2V 并联 50uA 30ppm/℃; Supplier Part: C5145284; Manufacturer: HGC(深圳汉芯); Supplier Footprint: SOT-23-3; JLCPCB Part Class: Extended Part; Datasheet: https://item.szlcsc.com/datasheet/LM385DBZ-1.2RG/5767651.html; Supplier: LCSC; Output Type: Fixed; Voltage - Supply: 1.2V; Output Voltage: 1.24V; Output Current: 20mA; Tolerance: ±0.3%; Temperature Coefficient: 30ppm/℃; Reference Type: Parallel; Quiescent Current: 50uA; Minimum Cathode Current for Regulation: 8uA; Noise - 10Hz to 10kHz: 60uVrms; Operating Temperature: 0℃~+70℃
U68 = rfid_antenna
BUZZER1 = MLT-7525: LCSC Part Name: 无源(外部驱动) 电磁式 2.7kHz; Supplier Part: C95299; Manufacturer: 华能; Supplier Footprint: SMD,7.5x7.5mm; JLCPCB Part Class: Extended Part; Datasheet: https://item.szlcsc.com/datasheet/MLT-7525/96501.html; Supplier: LCSC; Driver Circuitry: Passive (Externally Driven); Technology: Electromagnetic; Voltage Rating: 3.6V; Voltage - Supply: 2.5V~4.5V; Current Consumption: 95mA; Sound Pressure Level(SPL): 80dB; Length: 7.5mm; Width: 7.5mm; Height: 2.8mm; Operating Temperature: -20℃~+70℃
C1 = CL05A225KP5NSNC: LCSC Part Name: 2.2uF ±10% 10V; Supplier Part: C107369; Manufacturer: SAMSUNG(三星); Supplier Footprint: 0402; JLCPCB Part Class: Extended Part; Datasheet: https://item.szlcsc.com/datasheet/CL05A225KP5NSNC/108588.html; Supplier: LCSC; Tolerance: ±10%; Voltage Rating: 10V; Temperature Coefficient: X5R
C4 C7 C12-C14 = CA45-A010K106T: LCSC Part Name: 10uF ±10% 10V; Supplier Part: C119052; Manufacturer: 湘怡中元/湘江; Supplier Footprint: CASE-A-3216-16(mm); JLCPCB Part Class: Extended Part; Datasheet: https://item.szlcsc.com/datasheet/CA45-A010K106T/120321.html; Supplier: LCSC; Tolerance: ±10%; Voltage Rating: 10V; Equivalent Series Resistance(ESR): 3Ω@100kHz; Operating Temperature: -55℃~+125℃
C17 C36 = CL05A475KP5NRNC: LCSC Part Name: 4.7uF ±10% 10V; Supplier Part: C368809; Manufacturer: SAMSUNG(三星); Supplier Footprint: 0402; JLCPCB Part Class: Extended Part; Datasheet: https://item.szlcsc.com/datasheet/CL05A475KP5NRNC/342854.html; Supplier: LCSC; Tolerance: ±10%; Voltage Rating: 10V; Temperature Coefficient: X5R
CGQ1 = IRM-H638T/TR2: LCSC Part Name: 45°@水平 45°@垂直; Supplier Part: C91447; Manufacturer: EVERLIGHT(亿光); Supplier Footprint: SMD-4P,5x4mm; JLCPCB Part Class: Extended Part; Datasheet: https://www.everlighteurope.com/custom/files/datasheets/DMO-0000008.pdf; Supplier: LCSC; Voltage - Supply: 2.7V~5.5V; Current - Supply: 1.2mA; Operating Temperature: -25℃~+85℃
D1-D3 = 1N5819WS_C191023: LCSC Part Name: 电压:40V 电流:1A; Supplier Part: C191023; Manufacturer: Hottech(合科泰); Supplier Footprint: SOD-323; JLCPCB Part Class: Basic Part; Datasheet: https://item.szlcsc.com/datasheet/1N5819WS/213850.html; Supplier: LCSC; Voltage - Forward(Vf@If): 600mV@1A; Voltage - DC Reverse(Vr): 40V; Current - Rectified: 1A; Non-Repetitive Peak Forward Surge Current: 25A
H1 = PZ254V-12-6P: LCSC Part Name: 间距:2.54mm 2x3P 直插 方针; Supplier Part: C492420; Manufacturer: XFCN(兴飞); Supplier Footprint: 插件,P=2.54mm; JLCPCB Part Class: Extended Part; Datasheet: https://atta.szlcsc.com/upload/public/pdf/source/20200309/C492420_BAECB307B001054C09D200388220EAE6.pdf; Supplier: LCSC; Pin Structure: 2x3P; Pitch: 2.54mm; Row Spacing: 2.54mm; Circluar Pins/Square Pins: Square Pins; Mounting Type: Straight; Number of Rows: 双排; Number of Pins: 6P; Length of Mating Pin: 6mm; Insulation Height: 2.5mm; Length of End Connection Pin: 3mm; Operating Temperature Range: -40℃~+105℃; Color: Black
L1 = SDFL1608S100KTF: LCSC Part Name: 10uH ±10%; Supplier Part: C1035; Manufacturer: Sunlord(顺络); Supplier Footprint: 0603; JLCPCB Part Class: Basic Part; Datasheet: https://item.szlcsc.com/datasheet/SDFL1608S100KTF/1387.html; Supplier: LCSC; Tolerance: ±10%; Current Rating: 3mA; DC Resistance(DCR): 1.85Ω; Q @ Frequency: 30@2MHz; Frequency - Self Resonant: 17MHz
M1 = Z3OC1T8219731: Supplier Part: C2894731; Manufacturer: KOTL(金龙机电); JLCPCB Part Class: Extended Part; Datasheet: https://item.szlcsc.com/datasheet/Z3OC1T8219731/3130478.html; Supplier: LCSC; Type: Cylindrical DC Motor; Voltage Rating: 2.7V; Current Rating: 85mA; Rated Speed: 14000±2500rpm; Operating Temperature: -20℃~+70℃; Sense Of Rotation: CW
Q1-Q3 = L2N7002SLLT1G: LCSC Part Name: 1个N沟道 耐压:60V 电流:380mA; Supplier Part: C22446827; Manufacturer: LRC(乐山无线电); Supplier Footprint: SOT-23; JLCPCB Part Class: Extended Part; Datasheet: https://atta.szlcsc.com/upload/public/pdf/source/20240529/804683F6F610BC810C43B61F364F3FCA.pdf; Supplier: LCSC; Type: 1 N-channel; Drain to Source Voltage: 60V; RDS(on): 2.8Ω@10V,500mA; Pd - Power Dissipation: 300mW; Gate Charge(Qg): 440pC@4.5V; Input Capacitance(Ciss@Vds): 35pF@25V; Operating Temperature: -55℃~+150℃
R1 R8-R11 R15 R18-R21 = FRC0402F1004TS: LCSC Part Name: 1MΩ ±1% 62.5mW 厚膜电阻; Supplier Part: C2909328; Manufacturer: FOJAN(富捷); Supplier Footprint: 0402; JLCPCB Part Class: Extended Part; Supplier: LCSC; Type: Thick Film Resistor; Tolerance: ±1%; Power(Watts): 62.5mW; Voltage-Supply(Max): 50V; Temperature Coefficient: ±100ppm/℃; Operating Temperature: -55℃~+155℃
R5 = FRC0402P000 TS: LCSC Part Name: 0Ω ±5% 62.5mW 厚膜电阻; Supplier Part: C2906877; Manufacturer: FOJAN(富捷); Supplier Footprint: 0402; JLCPCB Part Class: Extended Part; Supplier: LCSC; Type: Thick Film Resistor; Tolerance: ±5%; Power(Watts): 62.5mW; Voltage-Supply(Max): 50V; Operating Temperature: -55℃~+155℃
R6 = FRC0402F5R10TS: LCSC Part Name: 5.1Ω ±1% 62.5mW 厚膜电阻; Supplier Part: C2909363; Manufacturer: FOJAN(富捷); Supplier Footprint: 0402; JLCPCB Part Class: Extended Part; Datasheet: https://item.szlcsc.com/datasheet/FRC0402F5R10TS/3186298.html; Supplier: LCSC; Type: Thick Film Resistor; Tolerance: ±1%; Power(Watts): 62.5mW; Voltage-Supply(Max): 50V; Temperature Coefficient: ±200ppm/℃; Operating Temperature: -55℃~+155℃
R7 = AC0805FR-7W22RL: LCSC Part Name: 厚膜电阻 22Ω ±1% 250mW; Supplier Part: C6492135; Manufacturer: YAGEO(国巨); Supplier Footprint: 0805; JLCPCB Part Class: Extended Part; Datasheet: https://item.szlcsc.com/datasheet/AC0805FR-7W22RL/7445319.html; Supplier: LCSC; Type: Thick Film Resistor; Tolerance: ±1%; Power(Watts): 250mW; Temperature Coefficient: ±100ppm/℃; Operating Temperature: -55℃~+155℃
R14 = FRC0402F2000TS: LCSC Part Name: 200Ω ±1% 62.5mW 厚膜电阻; Supplier Part: C2909333; Manufacturer: FOJAN(富捷); Supplier Footprint: 0402; JLCPCB Part Class: Extended Part; Supplier: LCSC; Type: Thick Film Resistor; Tolerance: ±1%; Power(Watts): 62.5mW; Voltage-Supply(Max): 50V; Temperature Coefficient: ±100ppm/℃; Operating Temperature: -55℃~+155℃
R16 = FRC0402F2002TS: LCSC Part Name: 20kΩ ±1% 62.5mW 厚膜电阻; Supplier Part: C2906867; Manufacturer: FOJAN(富捷); Supplier Footprint: 0402; JLCPCB Part Class: Extended Part; Datasheet: https://item.szlcsc.com/datasheet/FRC0402F2002TS/3180380.html; Supplier: LCSC; Type: Thick Film Resistor; Tolerance: ±1%; Power(Watts): 62.5mW; Voltage-Supply(Max): 50V; Temperature Coefficient: ±100ppm/℃; Operating Temperature: -55℃~+155℃
R24 R25 = FRC0402J222 TS: LCSC Part Name: 2.2kΩ ±5% 62.5mW 厚膜电阻; Supplier Part: C2906920; Manufacturer: FOJAN(富捷); Supplier Footprint: 0402; JLCPCB Part Class: Extended Part; Supplier: LCSC; Type: Thick Film Resistor; Tolerance: ±5%; Power(Watts): 62.5mW; Voltage-Supply(Max): 50V; Temperature Coefficient: ±100ppm/℃; Operating Temperature: -55℃~+155℃
R26 = 0402WGF1004TCE: LCSC Part Name: 1MΩ ±1% 62.5mW 厚膜电阻; Supplier Part: C26083; Manufacturer: UNI-ROYAL(厚声); Supplier Footprint: 0402; JLCPCB Part Class: Basic Part; Datasheet: https://item.szlcsc.com/datasheet/0402WGF1004TCE/26826.html; Supplier: LCSC; Type: Thick Film Resistor; Tolerance: ±1%; Power(Watts): 62.5mW; Voltage-Supply(Max): 50V; Temperature Coefficient: ±100ppm/℃; Operating Temperature: -55℃~+155℃
R27 = FRC0402J104 TS: LCSC Part Name: 100kΩ ±5% 62.5mW 厚膜电阻; Supplier Part: C2906883; Manufacturer: FOJAN(富捷); Supplier Footprint: 0402; JLCPCB Part Class: Extended Part; Supplier: LCSC; Type: Thick Film Resistor; Tolerance: ±5%; Power(Watts): 62.5mW; Voltage-Supply(Max): 50V; Temperature Coefficient: ±100ppm/℃; Operating Temperature: -55℃~+155℃
R30 R31 R36 R37 R39 = FRC0402F1001TS: LCSC Part Name: 1kΩ ±1% 62.5mW 厚膜电阻; Supplier Part: C2906864; Manufacturer: FOJAN(富捷); Supplier Footprint: 0402; JLCPCB Part Class: Extended Part; Supplier: LCSC; Type: Thick Film Resistor; Tolerance: ±1%; Power(Watts): 62.5mW; Voltage-Supply(Max): 50V; Temperature Coefficient: ±100ppm/℃; Operating Temperature: -55℃~+155℃
R49 = TC33X-2-103E: LCSC Part Name: 10kΩ ±25%; Supplier Part: C719176; Manufacturer: BOURNS; Supplier Footprint: SMD-3P,3.8x3.6mm; JLCPCB Part Class: Extended Part; Datasheet: https://item.szlcsc.com/datasheet/TC33X-2-103E/762158.html; Supplier: LCSC; Tolerance: ±25%; Power(Watts): 150mW; Temperature Coefficient: ±250ppm/℃
R54 = 0402WGF7502TCE: LCSC Part Name: 75kΩ ±1% 62.5mW 厚膜电阻; Supplier Part: C25798; Manufacturer: UNI-ROYAL(厚声); Supplier Footprint: 0402; JLCPCB Part Class: Extended Part; Datasheet: https://item.szlcsc.com/datasheet/0402WGF7502TCE/26541.html; Supplier: LCSC; Type: Thick Film Resistor; Tolerance: ±1%; Power(Watts): 62.5mW; Voltage-Supply(Max): 50V; Temperature Coefficient: ±100ppm/℃; Operating Temperature: -55℃~+155℃
U1-U3 = XL-2012IRC-940: LCSC Part Name: 940nm 30mA红外发射; Supplier Part: C965889; Manufacturer: XINGLIGHT(成兴光); Supplier Footprint: 0805; JLCPCB Part Class: Extended Part; Datasheet: https://item.szlcsc.com/datasheet/XL-2012IRC-940/1051498.html; Supplier: LCSC; Voltage - Forward(Vf): 1.2V~1.6V; Pd - Power Dissipation: 45mW; Wavelength: 939nm~946nm; Radiant Intensity: 2mW/sr; Current - DC Forward(If): 30mA; Voltage - DC Reverse(Vr): 5V; Viewing Angle: 120°; Operating Temperature: -40℃~+85℃
U4 = HAL403SO: LCSC Part Name: 线性霍尔传感器; Supplier Part: C42387470; Manufacturer: Hallwee(霍尔微电子); Supplier Footprint: SOT-23-3L; JLCPCB Part Class: Extended Part; Datasheet: https://item.szlcsc.com/datasheet/HAL403SO/44312210.html; Supplier: LCSC; Magnetic Field Range: ±50mT; Sensitivity: 4.1mV/Gs; Linearity: ±1.5%; Voltage - Supply: 1.6V~3.6V; Supply Current: 1.4mA; Operating Temperature: -40℃~+150℃
U5 = SSD1327_128x128
U6 = MT3540-F23: LCSC Part Name: 1.5A，1.2MHz升压转换器; Supplier Part: C181783; Manufacturer: 西安航天民芯; Supplier Footprint: SOT-23-5; JLCPCB Part Class: Extended Part; Datasheet: https://item.szlcsc.com/datasheet/MT3540-F23/193180.html; Supplier: LCSC; Function: Boost; Voltage - Supply: 2.5V~5.5V; Output Voltage: 1.23V~28V; Output Current: 1.5A; Frequency - Switching: 1.2MHz; Operating Temperature: -40℃~+85℃@(TA); Synchronous Rectifier: No; Number of Outputs: 1; Topology: Boost; Quiescent Current: 40uA; Switch tube (built-in/external): Built-in; Output Type: Adjustable
U7 = LSM6DS3TR: LCSC Part Name: MSL=3 LSM6DS3TR; Supplier Part: C95230; Manufacturer: ST(意法半导体); Supplier Footprint: LGA-14(2.5x3); JLCPCB Part Class: Extended Part; Datasheet: https://item.szlcsc.com/datasheet/LSM6DS3TR/96431.html; Supplier: LCSC; Sensor Type: Accelerometer gyroscope; Operating Temperature: -40℃~+85℃
U62 = LTR-308ALS-01: LCSC Part Name: 光学传感器; Supplier Part: C492382; Manufacturer: LITEON(光宝); Supplier Footprint: SMD; JLCPCB Part Class: Extended Part; Datasheet: https://item.szlcsc.com/datasheet/LTR-308ALS-01/503421.html; Supplier: LCSC; Measurement Type: Light Intensity; Photoperceptivity: 157klx; Interface: I2C; Voltage - Supply: 1.7V~3.6V; Operating Temperature: -40℃~+85℃
U63 = LMD2718T261-OA1: LCSC Part Name: MEMSmic数字硅麦2718 上进音 s-26db±1; Supplier Part: C5373237; Manufacturer: LinkMems(聆麦声学); Supplier Footprint: SMD-6P,2.8x1.9mm; JLCPCB Part Class: Extended Part; Datasheet: https://atta.szlcsc.com/upload/public/pdf/source/20240604/8A996F5B348F7613D841F153E3624C08.pdf; Supplier: LCSC; Direction: Omni-directional; Supply Voltage: 1.62V~3.6V; Current Consumption: 750uA; SNR(Signal to Noise Ratio): 58dB; Sensitivity: -26dB
U67 = open_solder_jumper
C15 = CA45-A-10V-22uF-K: LCSC Part Name: 22uF ±10% 10V; Supplier Part: C129272; Manufacturer: CEC(振华新云); Supplier Footprint: CASE-A-3216; JLCPCB Part Class: Extended Part; Datasheet: https://atta.szlcsc.com/upload/public/pdf/source/20170914/C129272_1505359928095968134.pdf; Supplier: LCSC; Tolerance: ±10%; Equivalent Series Resistance(ESR): 10Ω@100kHz; Operating Temperature: -55℃~+125℃
C18 C19 = 0402CG150J500NT: LCSC Part Name: 15pF ±5% 50V; Supplier Part: C1548; Manufacturer: FH(风华); Supplier Footprint: 0402; JLCPCB Part Class: Basic Part; Datasheet: https://item.szlcsc.com/datasheet/0402CG150J500NT/1900.html; Supplier: LCSC; Tolerance: ±5%; Voltage Rating: 50V; Temperature Coefficient: C0G
C20-C22 C34 = CL05A475MP5NRNC: LCSC Part Name: 4.7uF ±20% 10V; Supplier Part: C23733; Manufacturer: SAMSUNG(三星); Supplier Footprint: 0402; JLCPCB Part Class: Basic Part; Datasheet: https://item.szlcsc.com/datasheet/CL05A475MP5NRNC/24469.html; Supplier: LCSC; Tolerance: ±20%; Voltage Rating: 10V; Temperature Coefficient: X5R
C23-C33 = CL05A104KA5NNNC: LCSC Part Name: 100nF ±10% 25V; Supplier Part: C100072; Manufacturer: SAMSUNG(三星); Supplier Footprint: 0402; JLCPCB Part Class: Extended Part; Datasheet: https://item.szlcsc.com/datasheet/CL05A104KA5NNNC/101286.html; Supplier: LCSC; Tolerance: ±10%; Voltage Rating: 25V; Temperature Coefficient: X5R
L2 = AOTA-B201610S3R3-101-T: LCSC Part Name: 3.3uH 2.4A; Supplier Part: C42411119; Manufacturer: ABRACON; Supplier Footprint: 0806; JLCPCB Part Class: Extended Part; Datasheet: https://item.szlcsc.com/datasheet/AOTA-B201610S3R3-101-T/44392932.html; Supplier: LCSC; Current Rating: 2.1A; Current - Saturation(Isat): 2.4A; DC Resistance(DCR): 115mΩ; Type: Molded Inductor
R32 R33 = 0603WAF270JT5E: LCSC Part Name: 27Ω ±1% 100mW 厚膜电阻; Supplier Part: C25190; Manufacturer: UNI-ROYAL(厚声); Supplier Footprint: 0603; JLCPCB Part Class: Extended Part; Datasheet: https://item.szlcsc.com/datasheet/0603WAF270JT5E/25933.html; Supplier: LCSC; Type: Thick Film Resistor; Tolerance: ±1%; Power(Watts): 100mW; Voltage-Supply(Max): 75V; Temperature Coefficient: ±200ppm/℃; Operating Temperature: -55℃~+155℃
R34 R35 = FRC0603F5101TS: LCSC Part Name: 5.1kΩ ±1% 100mW 厚膜电阻; Supplier Part: C2907044; Manufacturer: FOJAN(富捷); Supplier Footprint: 0603; JLCPCB Part Class: Extended Part; Supplier: LCSC; Type: Thick Film Resistor; Tolerance: ±1%; Power(Watts): 100mW; Voltage-Supply(Max): 75V; Temperature Coefficient: ±100ppm/℃; Operating Temperature: -55℃~+155℃
R38 = FRC0402F33R0TS: LCSC Part Name: 33Ω ±1% 62.5mW 厚膜电阻; Supplier Part: C2906868; Manufacturer: FOJAN(富捷); Supplier Footprint: 0402; JLCPCB Part Class: Extended Part; Supplier: LCSC; Type: Thick Film Resistor; Tolerance: ±1%; Power(Watts): 62.5mW; Voltage-Supply(Max): 50V; Temperature Coefficient: ±100ppm/℃; Operating Temperature: -55℃~+155℃
SW1 SW2 = TS-1187A-B-A-B: LCSC Part Name: 5.1*5.1*1.5mm 立贴 轻触开关; Supplier Part: C318884; Manufacturer: XKB Connection(中国星坤); Supplier Footprint: SMD; JLCPCB Part Class: Basic Part; Datasheet: https://item.szlcsc.com/datasheet/TS-1187A-B-A-B/299976.html; Supplier: LCSC; Circuit: SPST; Actuator Style: Round Button; Operating Force: 1.6N; Mounting Type: Surface Mount,Vertical; Length: 5.1mm; Width: 5.1mm; Switch Height: 1.5mm; with Bracket: Without Bracket; Contact Current: 50mA; Voltage Rating: 12V; Actuator/Cap Color: Gold; With Lamp: No; Life: 100,000 Cycles; Operating Temperature: -30℃~+85℃
U8 = RP2350B_C42415655: LCSC Part Name: 微控制器; Supplier Part: C42415655; Manufacturer: Raspberry Pi(树莓派); Supplier Footprint: QFN-80-EP(10x10); JLCPCB Part Class: Extended Part; Datasheet: https://item.szlcsc.com/datasheet/RP2350B/44413055.html; Supplier: LCSC
U9 = LD1117-3.3: LCSC Part Name: 1A 低压差线性稳压器; Supplier Part: C347229; Manufacturer: UMW(友台半导体); Supplier Footprint: SOT-223; JLCPCB Part Class: Extended Part; Datasheet: https://item.szlcsc.com/datasheet/LD1117-3.3/323889.html; Supplier: LCSC; Output Type: Fixed; Voltage - Supply: 18V; Output Voltage: 3.3V; Output Current: 1A; Power Supply Rejection Ratio (PSRR): 60dB@(120Hz); Voltage Dropout: 1.3V@(1A); standby current: 10mA; Noise: 0.003%Vout; Features: Over Current Protection; Operating Temperature: -40℃~+125℃@(Tj); Output Configuration: Positive; Number of Outputs: 1
U10 = W25Q128JVSIQ_C113767: LCSC Part Name: 支持双路/四路SPI接口的3V、128Mbit 串行闪存; Supplier Part: C113767; Manufacturer: Winbond(华邦); Supplier Footprint: SOIC-8-208mil; JLCPCB Part Class: Extended Part; Datasheet: https://item.szlcsc.com/datasheet/W25Q128JVSIQ/115003.html; Supplier: LCSC; Interface: SPI; Clock Frequency: 133MHz; Voltage - Supply: 2.7V~3.6V; Program / Erase Cycles: 100,000 Cycles; Page Programming Time (Tpp): 3ms
U11 = ABM8-272-T3_C20625731: Supplier Part: C20625731; Manufacturer: ABRACON; Supplier Footprint: SMD3225-4P; JLCPCB Part Class: Extended Part; Datasheet: https://item.szlcsc.com/datasheet/ABM8-272-T3/22032038.html; Supplier: LCSC
USB1 = TYPE-C 16P QTWT: LCSC Part Name: 16P卧贴母座; Supplier Part: C5187472; Manufacturer: SHOU HAN(首韩); Supplier Footprint: SMD; JLCPCB Part Class: Extended Part; Datasheet: https://item.szlcsc.com/datasheet/TYPE-C%252016P%2520QTWT/5860367.html; Supplier: LCSC; Connector Type: Type-C; Gender: Female; Mounting Type: Surface Mount, Right Angle; Number of Contacts: 16P; Number of Ports: 1; Current Rating-Power: 3A; Voltage Rating: 5V; Connect-Disconnect Life: 5,000 cycles; Detection color: Black; Operating Temperature: -25℃~+85℃

## Nets
+1V1: C21.2 C23.2 C24.2 C34.1 L2.2 U8.10(DVDD) U8.32(DVDD) U8.51(DVDD) U8.65(VREG_FB)
+3V3: C1.2 C3.1 C5.1 C9.2 C10.2 C13.1 C15.1 C16.2 C17.2 C22.1 C25.2 C26.2 C27.2 C28.2 C29.2 C30.2 C31.2 C32.2 C33.2 C35.2 C36.2 C37.2 C38.2 H1.1 L1.1 R5.2 R6.2 R7.2 R14.2 R16.2 R24.2 R25.2 R28.2 R38.1 R49.1 R51.2 R53.2 U4.1(VCC) U5.5(VCI) U6.4(EN) U6.5(VIN) U7.1(SDO/SA0) U7.5(VDDIO) U7.8(VDD) U7.12(CS) U8.5(IOVDD) U8.15(IOVDD) U8.24(IOVDD) U8.29(IOVDD) U8.41(IOVDD) U8.50(IOVDD) U8.59(ADC_AVDD) U8.60(IOVDD) U8.64(VREG_VIN) U8.68(USB_OTP_VDD) U8.69(QSPI_IOVDD) U8.76(IOVDD) U9.2(VOUT(TAB)) U9.4(TAB) U10.8(VCC) U62.1(VDD) U63.2(L/R) U63.4(VDD) U65.8(VCC)
+5V_USB: C14.1 R52.2 U9.3(IN) USB1.A4(VBUS) USB1.A9(VBUS)
+15V: C4.1 C11.2 C12.1 D3.1(K) R27.2 U5.2(VCC) U5.24(VCC)
GND: C1.1 C3.2 C4.2 C5.2 C6.2 C7.2 C8.2 C9.1 C10.1 C12.2 C13.2 C14.2 C15.2 C16.1 C17.1 C18.1 C19.1 C20.1 C21.1 C22.2 C23.1 C24.1 C25.1 C26.1 C27.1 C28.1 C29.1 C30.1 C31.1 C32.1 C33.1 C34.2 C35.1 C36.1 C37.1 C38.1 CGQ1.1(GND) CGQ1.2(GND) D1.2(A) D2.2(A) H1.2 M1.3(EP) Q1.2(S) Q2.2(S) Q3.2(S) R2.2 R3.2 R4.2 R26.1 R29.1 R34.2 R35.2 R45.2 R49.3 R54.1 SW1.1(A) SW2.3(C) U4.2(GND) U5.1(GND) U5.4(GPIO) U5.7(BS1) U5.8(BS2) U5.9(GND) U5.14(WR#) U5.15(RD#) U5.18(D2) U5.19(D3) U5.20(D4) U5.21(D5) U5.22(D6) U5.23(D7) U5.25(GND) U6.2(GND) U7.2(SDX) U7.3(SCX) U7.6(GND) U7.7(GND) U8.62(VREG_PGND) U8.81(GND) U9.1(ADJ(GND)) U10.4(GND) U11.2(GND) U11.4(GND) U17.3 U18.1 U18.3 U62.3(GND) U63.1(GND) U63.3(GND) U65.4(VSS) U66.2(ANODE) U66.3(FB) U69.1 U69.3 USB1.0(EH) USB1.A1(GND) USB1.A12(GND)
BOOTSEL: R36.2 SW1.3(C)
BUZZER: Q1.1(G) R2.1 U8.26(GPIO25)
CAPTOUCH_00: R1.1 TOUCH_FACE1.1 U8.28(GPIO27)
CAPTOUCH_01: R8.1 TOUCH_MENU1.1 U8.36(GPIO28)
CAPTOUCH_02: R9.1 TOUCH_YES1.1 U8.37(GPIO29)
CAPTOUCH_03: R10.1 TOUCH_NO1.1 U8.38(GPIO30)
CAPTOUCH_04: R11.1 TOUCH_CCW1.1 U8.39(GPIO31)
CAPTOUCH_05: R15.1 TOUCH_UP1.1 U8.40(GPIO32)
CAPTOUCH_06: R18.1 TOUCH_CW1.1 U8.42(GPIO33)
CAPTOUCH_07: R19.1 TOUCH_LEFT1.1 U8.43(GPIO34)
CAPTOUCH_08: R20.1 TOUCH_DOWN1.1 U8.44(GPIO35)
CAPTOUCH_09: R21.1 TOUCH_RIGHT1.1 U8.45(GPIO36)
CAPTOUCH_RET: R1.2 R8.2 R9.2 R10.2 R11.2 R15.2 R18.2 R19.2 R20.2 R21.2 U8.27(GPIO26)
CC1: R34.1 USB1.A5(CC1)
CC2: R35.1 USB1.B5(CC2)
DEBUG_G: U8.47(GPIO38) U17.4
DEBUG_R: U8.46(GPIO37) U17.2
DM: R33.2 U8.66(USB_DM)
DMX: R33.1 USB1.A7(DN1) USB1.B7(DN2)
DP: R32.2 U8.67(USB_DP)
DPX: R32.1 USB1.A6(DP1) USB1.B6(DP2)
HALL: C6.1 U4.3(OUT) U8.52(GPIO41_ADC1)
IMU_INT1: U7.4(INT1)
IMU_INT2: U7.9(INT2)
IR_RXD: CGQ1.3(VOUT) R16.1 U8.54(GPIO43_ADC3)
IR_TXD: Q2.1(G) R3.1 U8.25(GPIO24)
MAT00: U8.80(GPIO3) U14.1 U14.3 U16.1 U16.3 U20.1 U20.3 U26.2 U26.4 U28.2 U28.4 U32.2 U32.4
MAT01: U8.2(GPIO5) U13.1 U13.3 U15.1 U15.3 U21.1 U21.3 U27.2 U27.4 U29.2 U29.4 U33.2 U33.4
MAT02: R40.1 U8.3(GPIO6) U12.1 U12.3 U22.1 U22.3 U30.2 U30.4 U34.2 U34.4
MAT02R: R40.2 U14.2 U15.2 U26.1 U27.1
MAT03: U8.4(GPIO7) U14.4 U15.4 U19.1 U19.3 U23.1 U23.3 U26.3 U27.3 U31.2 U31.4 U35.2 U35.4
MAT04: U8.1(GPIO4) U12.4 U13.4 U16.4 U19.4 U24.1 U24.3 U28.3 U29.3 U30.3 U31.3 U36.2 U36.4
MAT05: R43.1 TP6.1 U8.78(GPIO1) U25.1 U25.3 U37.2 U37.4
MAT05R: R43.2 U12.2 U13.2 U16.2 U19.2 U28.1 U29.1 U30.1 U31.1
MAT06: U8.79(GPIO2) U20.4 U21.4 U22.4 U23.4 U24.4 U25.4 U32.3 U33.3 U34.3 U35.3 U36.3 U37.3
MAT07: R44.1 TP5.1 U8.77(GPIO0)
MAT07R: R44.2 U20.2 U21.2 U22.2 U23.2 U24.2 U25.2 U32.1 U33.1 U34.1 U35.1 U36.1 U37.1
MAT10: U8.17(GPIO17) U44.2 U44.4 U49.2 U49.4 U50.1 U50.3 U52.1 U52.3 U58.2 U58.4 U61.1 U61.3
MAT11: U8.20(GPIO20) U41.1 U41.3 U43.2 U43.4 U51.2 U51.4 U53.1 U53.3 U56.1 U56.3 U60.2 U60.4
MAT12: R48.1 U8.16(GPIO16) U42.2 U42.4 U55.1 U55.3 U57.1 U57.3 U59.2 U59.4
MAT12R: R48.2 U43.1 U53.2 U58.1 U61.2
MAT13: U8.21(GPIO21) U39.1 U39.3 U43.3 U45.2 U45.4 U46.2 U46.4 U53.4 U54.1 U54.3 U58.3 U61.4
MAT14: U8.22(GPIO22) U38.1 U38.3 U39.4 U42.3 U46.3 U48.2 U48.4 U49.3 U50.4 U51.3 U55.4 U56.4
MAT15: R47.1 U8.23(GPIO23) U40.1 U40.3 U47.2 U47.4
MAT15R: R47.2 U39.2 U42.1 U46.1 U49.1 U50.2 U51.1 U55.2 U56.2
MAT16: U8.19(GPIO19) U38.4 U40.4 U41.4 U44.3 U45.3 U47.3 U48.3 U52.4 U54.4 U57.4 U59.3 U60.3
MAT17: R46.1 U8.18(GPIO18)
MAT17R: R46.2 U38.2 U40.2 U41.2 U44.1 U45.1 U47.1 U48.1 U52.2 U54.2 U57.2 U59.1 U60.1
MIC_CLK: U8.14(GPIO15) U63.6(CLK)
MIC_DATA: U8.13(GPIO14) U63.5(DATA)
MOTOR: Q3.1(G) R4.1 U8.48(GPIO39)
OLED_CS: U5.11(CS#) U8.7(GPIO9)
OLED_DC: U5.13(D/C) U8.6(GPIO8)
OLED_MOSI: U5.17(D1) U8.9(GPIO11)
OLED_SCK: U5.16(D0) U8.8(GPIO10)
QSPI_SCLK: U8.71(QSPI_SCLK) U10.6(CLK)
QSPI_SD0: U8.72(QSPI_SD0) U10.5(DI(IO0))
QSPI_SD1: U8.74(QSPI_SD1) U10.2(DO(IO1))
QSPI_SD2: U8.73(QSPI_SD2) U10.3(WP#(IO2))
QSPI_SD3: U8.70(QSPI_SD3) U10.7(HOLD#orRESET#(IO3))
QSPI_SS: R36.1 U8.75(QSPI_SS) U10.1(CS#)
SAO_GPIO_1: R30.1 U8.55(GPIO44_ADC4)
SAO_GPIO_2: R31.1 U8.56(GPIO45_ADC5)
SAO_I2C_SCL: H1.4 U8.58(GPIO47_ADC7)
SAO_I2C_SDA: H1.3 U8.57(GPIO46_ADC6)
SCREW: R49.2 U8.53(GPIO42_ADC2)
SEN_I2C_SCL: R24.1 U7.13(SCL) U8.12(GPIO13) U62.4(SCL) U65.6(SCL)
SEN_I2C_SDA: R25.1 U7.14(SDA) U8.11(GPIO12) U62.6(SDA) U65.5(SDA)
SWCLK: TP3.1 U8.33(SWCLK)
SWDIO: TP4.1 U8.34(SWDIO)
V_EH: U65.1(V_EH) U69.2
V_REF: R51.1 U8.49(GPIO40_ADC0) U66.1(CATHODE)
VREG_AVDD: C20.2 R38.2 U8.61(VREG_AVDD)
VREG_LX: L2.1 U8.63(VREG_LX)
XIN: C19.2 U8.30(XIN) U11.1
XOUT: R37.2 U8.31(XOUT)
~RESET: R39.1 U8.35(RUN)
$1N3486: CGQ1.4(VCC) R14.1
$1N6944: BUZZER1.2(-) D1.1(K) Q1.3(D)
$1N6962: BUZZER1.1(+) R5.1
$1N7795: Q2.3(D) U1.1(K) U2.1(K) U3.1(K)
$1N8193: D2.1(K) M1.2(-) Q3.3(D)
$1N8196: M1.1(+) R6.1
$1N14534: D3.2(A) L1.2 U6.1(SW)
$1N14756: C11.1 R27.1 R29.2 R54.2 U6.3(FB)
$1N14907: C7.1 U5.3(VCOMH)
$1N15115: C8.1 U5.6(VDD)
$1N15148: R26.2 U5.10(IREF)
$1N15256: R28.1 U5.12(RES#)
$1N50651: R7.1 U3.2(A) U67.1
$1N50659: U1.2(A) U2.2(A) U67.2
$1N50975: H1.6 R31.2
$1N50977: H1.5 R30.2
$2N2498: R52.1 U18.2
$2N5849: R45.1 U17.1
$2N8504: R53.1 U18.4
$2N8848: TP1.1 U65.7(GPO(OD))
$4N3211: C18.2 R37.1 U11.3
$4N13731: R39.2 SW2.1(A)

Not connected (* = marked no-connect by the designer): BUZZER1 3* 4*; SW1 2(B)* 4(D)*; SW2 2(B)* 4(D)*; U7 10(NC)* 11(NC)*; U62 2(NC)* 5(INT)*; U65 2(AC0) 3(AC1) 9(EP)*; U68 1 2; U69 4*; USB1 A8(SBU1)* B8(SBU2)*

## Notes on the sheets
sheet 1
- Buzzer
  3.3V, 95 mA
- Infrared TXD
  1.2~1.5Vf, 30 mA/LED
- Vibration Motor
  2.7V,  85 mA
- Solder IR TxD jumper
  to triple IR brightness
- Microphone
- Ambient Light Sensor
  I2C Address 0x53
- L/R = GND, read on CLK rising edge
  L/D = 3V3, read on falling edge
- Infrared RXD
  Decodes presence/absence
  of 38kHz pulses of 940 nm
- Hall Effect Sensor
  +/-50mT, 4.1mV/Gs
- Screen SSD1327
  70 mA
- IMU
  Accelerometer/Gyroscope
  400kHz I2C
  I2C Addres 0x6B
- 3V3 decoupling
- I2C pull-up
- Screen 15V
- SAO
  v1.69bis
  2*3 100 mil
  3V3/GND, I2C, 2x GPIO
- 1.1 mHP ~ 0.82W
  3.3V, 250 mA
- Potentiometer
- SWD
- TxD
- RxD
sheet 2
- TODO: Antenna/Inductor
- V_Ref
- RFID
- Power ON LEDs
- Debug LEDs
- 1%
- MAT VCC>GND ID
- MAT VCC<GND ID
- Voltage dropper for red LEDs
- red pins1-2, max 2.3V
  green pins3-4,max3.3V
sheet 3
- Processor
  RP2350B
- USB-to-SAO Power
  5V/3.3V LDO Buck
  >500mA
- Internal Regulator
  1V1, <200mA
- IOVDD Decouple
- Clock
  12 MHz
- Memory
  16MByte Non-volatile Flash
- X5R Memory?
- OLED
  SPI1 TXD(MOSI)/SCLK
  GP8-11
- IMU
  I2C0 Master
  GP12-13
- crystal: footprint broken, wil raise device standardization error
- Boot Selection Buttons
- USB-C, USB2.0
  5V 500mA max
- 27Ω place close to RP2350
- IOVDD Decouple
- SAO
  I2C1 Slave
  GP46-47
- DVDD Decouple
sheet 4
- MAT VCC>GND ID
- MAT VCC<GND ID
